# EAGLE design crunchboy (EAGLE 6.6.0)
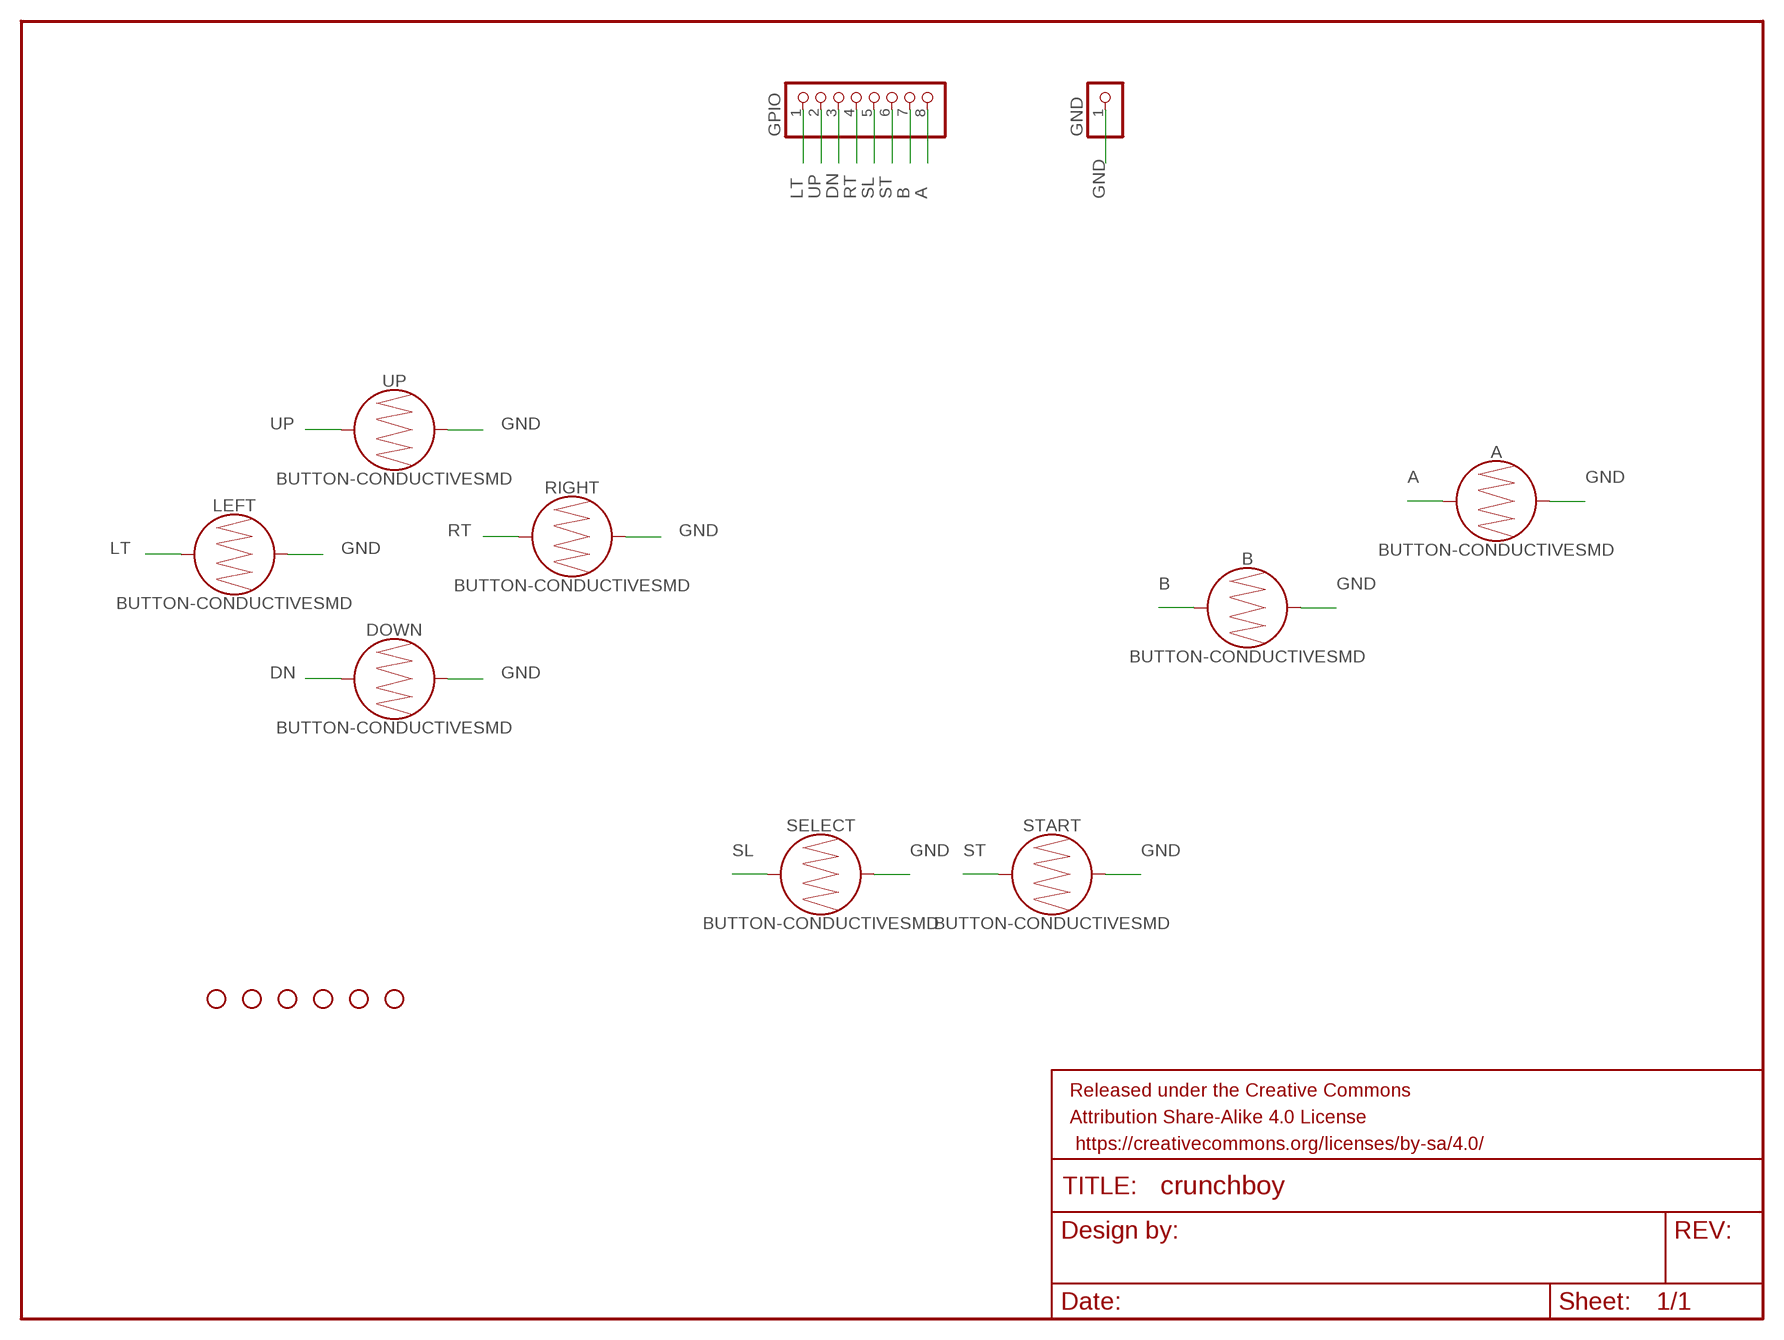
[diagram p0: schematic, sheet 1]

## Parts
A  BUTTON-CONDUCTIVESMD  [BUTTON-CONDUCTIVE]
B  BUTTON-CONDUCTIVESMD  [BUTTON-CONDUCTIVE]
DOWN  BUTTON-CONDUCTIVESMD  [BUTTON-CONDUCTIVE]
FRAME1  FRAME-LETTER  [CREATIVE_COMMONS]
GND  PINHD-1X1  [1X01]
GPIO  PINHD-1X8  [1X08]
H10  STAND-OFF  [STAND-OFF]
H11  STAND-OFF  [STAND-OFF]
H12  STAND-OFF  [STAND-OFF]
H13  STAND-OFF  [STAND-OFF]
H15  STAND-OFF  [STAND-OFF]
H16  STAND-OFF  [STAND-OFF]
LEFT  BUTTON-CONDUCTIVESMD  [BUTTON-CONDUCTIVE]
RIGHT  BUTTON-CONDUCTIVESMD  [BUTTON-CONDUCTIVE]
SELECT  BUTTON-CONDUCTIVESMD  [BUTTON-CONDUCTIVE]
START  BUTTON-CONDUCTIVESMD  [BUTTON-CONDUCTIVE]
UP  BUTTON-CONDUCTIVESMD  [BUTTON-CONDUCTIVE]

## Nets
A: A.1 GPIO.8
B: B.1 GPIO.7
DN: DOWN.1 GPIO.3
GND: A.2 B.2 DOWN.2 GND.1 LEFT.2 RIGHT.2 SELECT.2 START.2 UP.2
LT: GPIO.1 LEFT.1
RT: GPIO.4 RIGHT.1
SL: GPIO.5 SELECT.1
ST: GPIO.6 START.1
UP: GPIO.2 UP.1

## Library data of the parts
A B DOWN LEFT RIGHT SELECT START UP = SparkFun-Switches:BUTTON-CONDUCTIVE: Conductive Button Used with rubber key pads on the Nordic Key FOB <https://www.sparkfun.com/products/retired/8602>. This one was designed and proven to work with the PolyCase Key FOB enclosures <https://www.sparkfun.com/products/retired/9377>. SparkFun Products Nordic Fob <https://www.sparkfun.com/products/retired/8602> (WRL-08602)
FRAME1 = SparkFun-Aesthetics:FRAME-LETTER: Schematic Frame - Letter Standard 8.5x11 US Letter frame
GND = pinhead:PINHD-1X1: PIN HEADER
GPIO = pinhead:PINHD-1X8: PIN HEADER
H10-H13 H15 H16 = SparkFun-Hardware:STAND-OFF: Stand Off Drill holes for mechanically mounting via screws, standoffs, etc. Note: Use the keepout ring to avoid running the screw head into surrounding components. Variant Overviews STAND-OFF - Mechanical footprint for a #4 phillips button head screw. STAND-OFF-TIGHT - Mechanical footprint for a #4 phillips button head screw, Example SparkFun Products Screw - Phillips Head (1/4", 4-40, 10 pack) <https://www.sparkfun.com/products/10453> (PRT-10453) Screw - Phillips Head (1/2", 4-40, 10 pack) <https://www.sparkfun.com/products/10452> (PRT-10452) Screw - Phillips Head (3/4", 4-40, 10 pack) <https://www.sparkfun.com/products/10451> (PRT-10451) Screw - Phillips Head (1", 4-40, 10 pack) <https://www.sparkfun.com/products/10450> (PRT-10450)

## Board
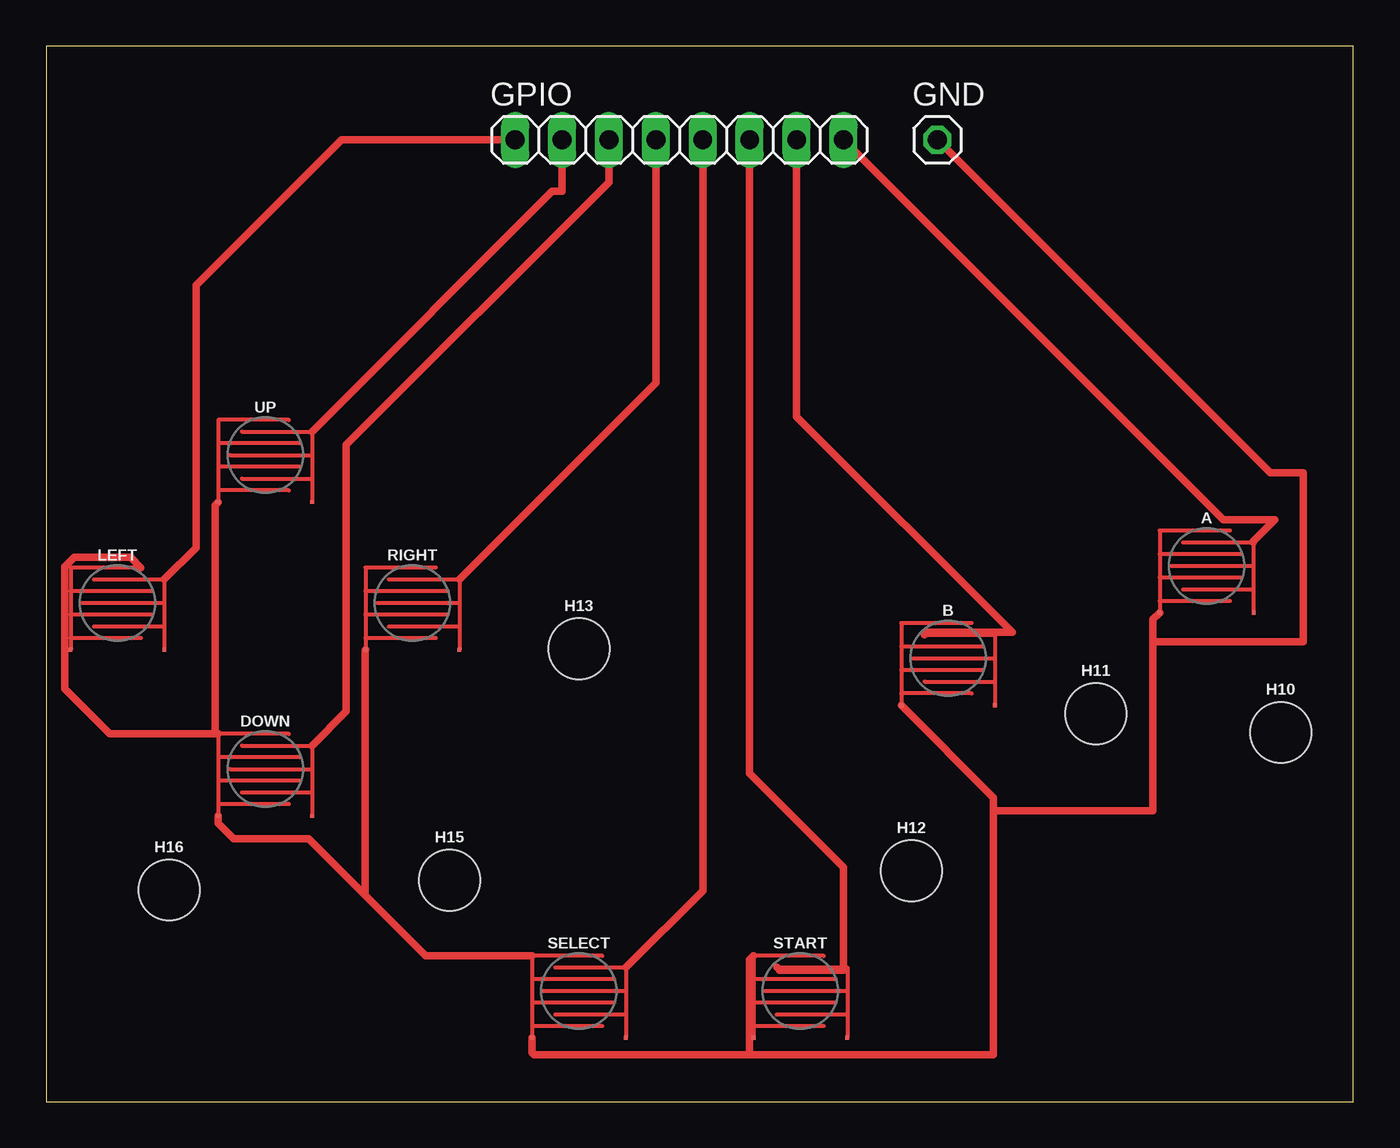
[diagram p1: board, top side]

Size 70.79 x 57.14 mm. Coordinates in mm from the lower left corner, seen from the top.
Outline: 0,0 70.79,0 70.79,57.14 0,57.14 0,0
Copper layers (1*16): Top 0.035mm / dielectric 1.5mm / Bottom 0.035mm
Design rules "default": minimum track width 10mil, minimum drill 24mil, track to track 8mil, track to pad 8mil, pad to pad 8mil, via to via 8mil, smd to smd 8mil, copper to edge 40mil, drill to drill 8mil, minimum pad ring 10mil, minimum via ring 8mil, stop-mask expansion 4mil, vias tented up to drill 0mil, thermal gap 10mil

### Footprints (pad centres in the part's own frame; a part is rotated, then mirrored left to right if it is on the bottom)
BUTTON-CONDUCTIVE = smd 0.203 x 0.203: 1 2.54,2.54; 2 2.54,-2.54
1X01 = drill 1.016 octagon: 1 0,0
1X08 = drill 1.016 long: 1 -8.89,0; 2 -6.35,0; 3 -3.81,0; 4 -1.27,0; 5 1.27,0; 6 3.81,0; 7 6.35,0; 8 8.89,0
STAND-OFF = hole 3.302: 0,0

### Placement (x,y rotation side)
A  62.84,29.01 270 top
B  48.84,24 270 top
DOWN  11.86,18.01 270 top
FRAME1  -101.6,26.67 0 top  (outside the outline)
GND  48.26,52.07 0 top
GPIO  34.29,52.07 0 top
H10  66.85,19.99 0 top
H11  56.85,21.01 0 top
H12  46.86,12.5 0 top
H13  28.85,24.51 0 top
H15  21.84,11.99 0 top
H16  6.65,11.46 0 top
LEFT  3.86,27 270 top
RIGHT  19.84,27 270 top
SELECT  28.85,5.99 270 top
START  40.84,5.99 270 top
UP  11.86,35 270 top

### Tracks (layer width: path | path; a pad name or v marks a point on that pad's centre or on a via)
A
  Top 0.406: GPIO.8 63.75,31.5 66.55,31.5 65.38,30.33 65.38,30.28
B
  Top 0.406: 47.57,25.27 47.7,25.4 52.32,25.4 40.64,37.08 GPIO.7
DN
  Top 0.406: 14.4,19.28 16.26,21.13 16.26,35.56 30.48,49.78 GPIO.3
GND
  Top 0.406: 5.13,28.91 4.57,29.46 1.52,29.46 1.02,28.96 1.02,22.35 3.45,19.91 9.14,19.91 | 9.14,19.91 9.32,19.91 | UP.2 9.14,32.28 9.14,19.91 | RIGHT.2 17.27,24.43 17.27,11.18 | 17.27,11.18 14.22,14.22 10.16,14.22 9.32,15.06 DOWN.2 | 17.27,11.18 20.55,7.9 26.31,7.9 | 38.3,7.9 38.1,7.7 38.1,2.54 | 38.1,2.54 26.42,2.54 26.31,2.64 SELECT.2 | B.2 51.31,16.46 51.31,15.75 | 51.31,15.75 51.31,2.54 38.1,2.54 | A.2 59.94,26.11 59.94,24.89 | 59.94,24.89 59.94,15.75 51.31,15.75 | GND.1 66.29,34.04 68.07,34.04 68.07,24.89 59.94,24.89
LT
  Top 0.406: 6.4,28.27 8.13,30 8.13,44.2 16,52.07 GPIO.1
RT
  Top 0.406: 22.38,28.27 33.02,38.91 GPIO.4
SL
  Top 0.406: 31.39,7.26 35.56,11.43 GPIO.5
ST
  Top 0.406: 39.57,7.26 39.73,7.11 43.18,7.11 43.18,12.7 38.1,17.78 GPIO.6
UP
  Top 0.406: 14.4,36.27 27.41,49.28 27.94,49.28 GPIO.2